# Altium project modFOC-ESC.PrjPcb
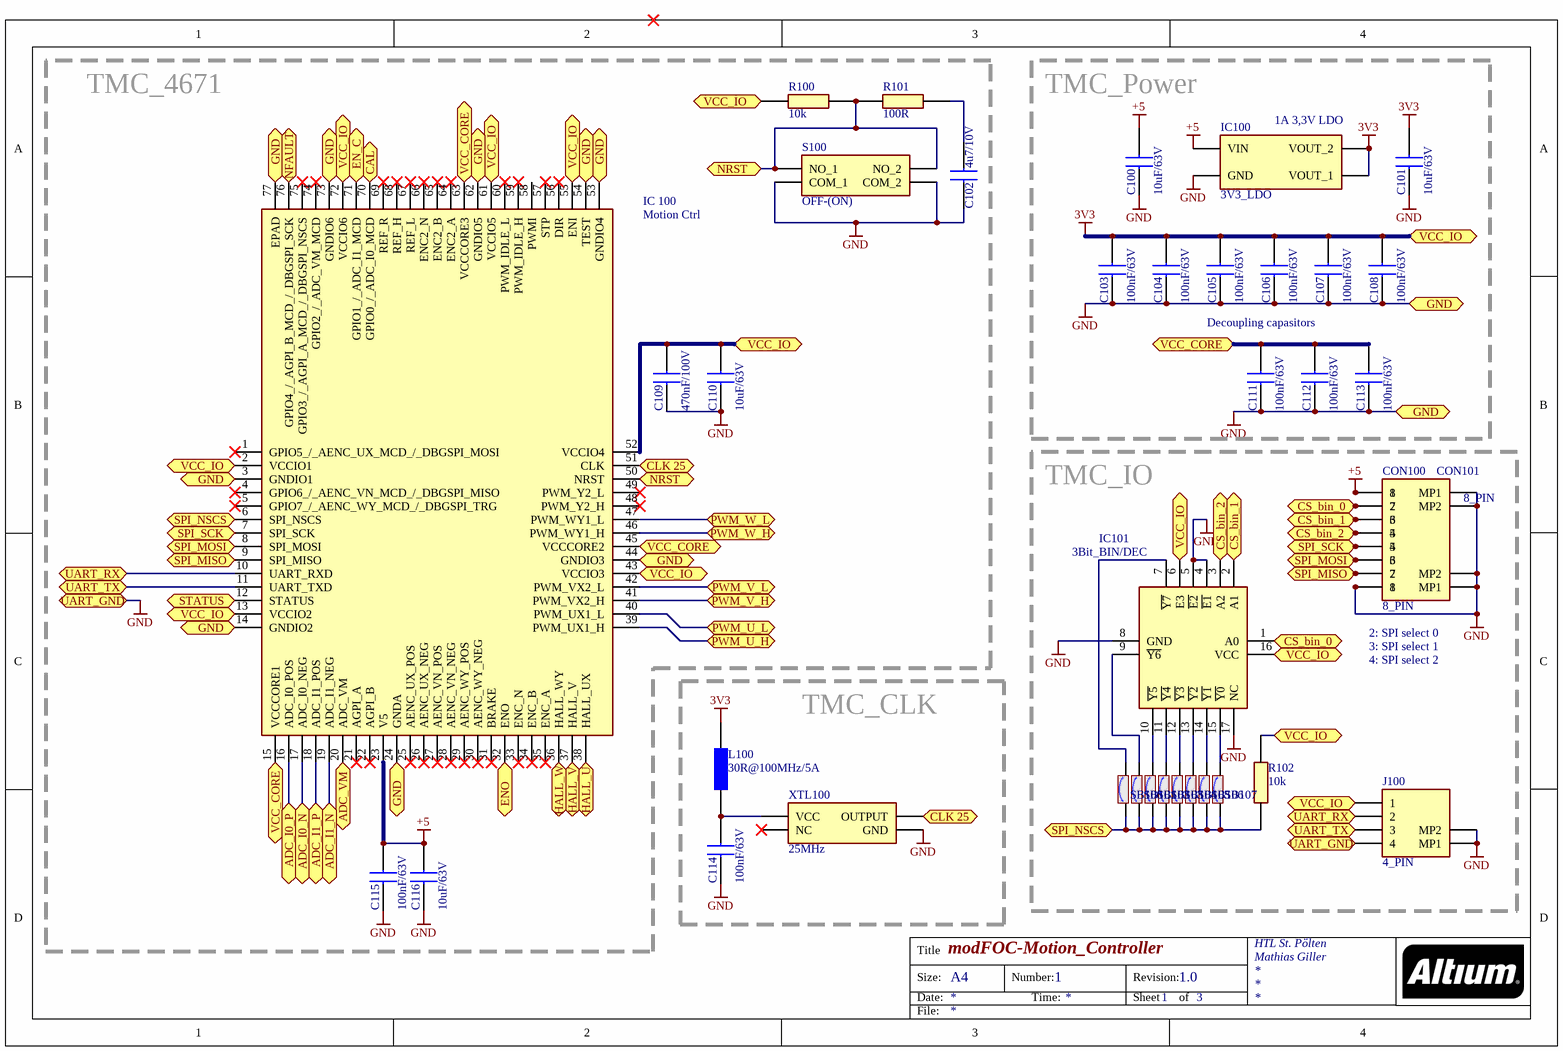
[diagram p0: modFOC-Motion_Controller.SchDoc]
3 sheets, 112 parts. Net scope: flat (ports and power ports of the same name join across sheets).
Board file: modFOC_ESC.PcbDoc
Sheets:
  modFOC-Motion_Controller.SchDoc
  modFOC-Sensing.SchDoc
  modFOC-Powerstage.SchDoc

## Sheet modFOC-Motion_Controller.SchDoc: modFOC-Motion_Controller
size A4; Date: dssd; Organization: HTL St. Pölten; Address1: Mathias Giller; DocumentNumber: 1; Revision: 1.0; SheetNumber: 1; SheetTotal: 3

### Parts
C100  10uF/63V  [CAPC3225X280N]
C101  10uF/63V  [CAPC3225X280N]
C102  4u7/10V  [CAPC1608X90N]
C103  100nF/63V  [CAPC1608X97N]
C104  100nF/63V  [CAPC1608X97N]
C105  100nF/63V  [CAPC1608X97N]
C106  100nF/63V  [CAPC1608X97N]
C107  100nF/63V  [CAPC1608X97N]
C108  100nF/63V  [CAPC1608X97N]
C109  470nF/100V  [CAPC2012X140N]
C110  10uF/63V  [CAPC3225X280N]
C111  100nF/63V  [CAPC1608X97N]
C112  100nF/63V  [CAPC1608X97N]
C113  100nF/63V  [CAPC1608X97N]
C114  100nF/63V  [CAPC1608X97N]
C115  100nF/63V  [CAPC1608X97N]
C116  10uF/63V  [CAPC3225X280N]
CON100  8_PIN  [DF13A8P125H21]
CON101  8_PIN  [DF13A8P125H21]
IC100  3V3_LDO  [SOT230P700X180-4N]
IC101  3Bit_BIN/DEC  [74HCT595BQ115]
IC_100  Motion Ctrl  [QFN40P1050X650X90-77N]
J100  4_PIN  [DF13A4P125H21]
L100  30R@100MHz/5A  [BLM18KG101TH1D]
R100  10k  [RESC1608X55N]
R101  100R  [RESC1608X55N]
R102  10k  [RESC1608X55N]
S100  OFF-(ON)  [PTS647SK38SMTR2LFS]
SB100  Solder Bridge  [SOLDER-BRIDGE_R0603-0R]  (value not drawn)
SB101  Solder Bridge  [SOLDER-BRIDGE_R0603-0R]  (value not drawn)
SB102  Solder Bridge  [SOLDER-BRIDGE_R0603-0R]  (value not drawn)
SB103  Solder Bridge  [SOLDER-BRIDGE_R0603-0R]  (value not drawn)
SB104  Solder Bridge  [SOLDER-BRIDGE_R0603-0R]  (value not drawn)
SB105  Solder Bridge  [SOLDER-BRIDGE_R0603-0R]  (value not drawn)
SB106  Solder Bridge  [SOLDER-BRIDGE_R0603-0R]  (value not drawn)
SB107  Solder Bridge  [SOLDER-BRIDGE_R0603-0R]  (value not drawn)
XTL100  25MHz  [FOX924B25]

### Blocks framed on the sheet
TMC_4671: C102 C109 C110 C115 C116 IC_100 R100 R101 S100
TMC_Power: C100 C101 C103-C108 C111-C113 IC100
TMC_IO: CON100 CON101 IC101 J100 R102 SB100-SB107
TMC_CLK: C114 L100 XTL100

### Ports
ADC_I0_N (bidir), ADC_I0_P (bidir), ADC_I1_N (bidir), ADC_I1_P (bidir), ADC_VM (bidir), CAL (bidir), CLK 25 (bidir), CS_bin_0 (bidir), CS_bin_1 (bidir), CS_bin_2 (bidir), EN_C (bidir), ENO (bidir), GND (bidir), HALL_U (bidir), HALL_V (bidir), HALL_W (bidir), NFAULT (bidir), NRST (bidir), PWM_U_H (bidir), PWM_U_L (bidir), PWM_V_H (bidir), PWM_V_L (bidir), PWM_W_H (bidir), PWM_W_L (bidir), SPI_MISO (bidir), SPI_MOSI (bidir), SPI_NSCS (bidir), SPI_SCK (bidir), STATUS (bidir), UART_GND (bidir), UART_RX (bidir), UART_TX (bidir), VCC_CORE (bidir), VCC_IO (bidir)

### Nets
3V3: C101.1 C103.2 C104.2 C105.2 C106.2 C107.2 C108.2 C109.2 C110.1 IC100.2(VOUT_1) IC100.4(VOUT_2) IC101.6(E3) IC101.16(VCC) IC_100.2(VCCIO1) IC_100.13(VCCIO2) IC_100.43(VCCIO3) IC_100.52(VCCIO4) IC_100.55(ENI) IC_100.61(VCCIO5) IC_100.72(VCCIO6) J100.1 L100.1 R100.1 R102.2 ; port VCC_IO
+5: C100.1 C115.2 C116.1 CON100.1 CON101.8 IC100.3(VIN) IC_100.23(V5)
GND: C100.2 C101.2 C102.1 C103.1 C104.1 C105.1 C106.1 C107.1 C108.1 C109.1 C110.2 C111.1 C112.1 C113.1 C114.1 C115.1 C116.2 CON100.8 CON100.MP1 CON100.MP2 CON101.1 CON101.MP1 CON101.MP2 IC100.1(GND) IC101.4(~{E1}) IC101.5(~{E2}) IC101.8(GND) IC101.17(NC) IC_100.3(GNDIO1) IC_100.14(GNDIO2) IC_100.24(GNDA) IC_100.44(GNDIO3) IC_100.53(GNDIO4) IC_100.54(TEST) IC_100.62(GNDIO5) IC_100.73(GNDIO6) IC_100.77(EPAD) J100.4 J100.MP1 J100.MP2 S100.3(COM_1) S100.4(COM_2) XTL100.2(GND) ; port GND, port UART_GND
ADC_I0_N: IC_100.17(ADC_I0_NEG) ; port ADC_I0_N
ADC_I0_P: IC_100.16(ADC_I0_POS) ; port ADC_I0_P
ADC_I1_N: IC_100.19(ADC_I1_NEG) ; port ADC_I1_N
ADC_I1_P: IC_100.18(ADC_I1_POS) ; port ADC_I1_P
ADC_VM: IC_100.20(ADC_VM) ; port ADC_VM
CAL: IC_100.70(GPIO0_/_ADC_I0_MCD) ; port CAL
CLK 25: IC_100.51(CLK) XTL100.3(OUTPUT) ; port CLK 25
CS_bin_0: CON100.2 CON101.7 IC101.1(A0) ; port CS_bin_0
CS_bin_1: CON100.3 CON101.6 IC101.2(A1) ; port CS_bin_1
CS_bin_2: CON100.4 CON101.5 IC101.3(A2) ; port CS_bin_2
EN_C: IC_100.71(GPIO1_/_ADC_I1_MCD) ; port EN_C
ENO: IC_100.32(ENO) ; port ENO
HALL_U: IC_100.38(HALL_UX) ; port HALL_U
HALL_V: IC_100.37(HALL_V) ; port HALL_V
HALL_W: IC_100.36(HALL_WY) ; port HALL_W
NFAULT: IC_100.76(GPIO4_/_AGPI_B_MCD_/_DBGSPI_SCK) ; port NFAULT
NRST: IC_100.50(NRST) R100.2 R101.1 S100.1(NO_1) S100.2(NO_2) ; port NRST
PWM_U_H: IC_100.39(PWM_UX1_H) ; port PWM_U_H
PWM_U_L: IC_100.40(PWM_UX1_L) ; port PWM_U_L
PWM_V_H: IC_100.41(PWM_VX2_H) ; port PWM_V_H
PWM_V_L: IC_100.42(PWM_VX2_L) ; port PWM_V_L
PWM_W_H: IC_100.46(PWM_WY1_H) ; port PWM_W_H
PWM_W_L: IC_100.47(PWM_WY1_L) ; port PWM_W_L
SPI_MISO: CON100.7 CON101.2 IC_100.9(SPI_MISO) ; port SPI_MISO
SPI_MOSI: CON100.6 CON101.3 IC_100.8(SPI_MOSI) ; port SPI_MOSI
SPI_NSCS: IC_100.6(SPI_NSCS) R102.1 SB100.1 SB101.1 SB102.1 SB103.1 SB104.1 SB105.1 SB106.1 SB107.1 ; port SPI_NSCS
SPI_SCK: CON100.5 CON101.4 IC_100.7(SPI_SCK) ; port SPI_SCK
STATUS: IC_100.12(STATUS) ; port STATUS
UART_RX: IC_100.10(UART_RXD) J100.2 ; port UART_RX
UART_TX: IC_100.11(UART_TXD) J100.3 ; port UART_TX
VCC_CORE: C111.2 C112.2 C113.2 IC_100.15(VCCCORE1) IC_100.45(VCCCORE2) IC_100.63(VCCCORE3) ; port VCC_CORE
NetC102_2: C102.2 R101.2
NetC114_2: C114.2 L100.2 XTL100.4(VCC)
NetIC101_7: IC101.7(~{Y7}) SB100.2
NetIC101_9: IC101.9(~{Y6}) SB101.2
NetIC101_10: IC101.10(~{Y5}) SB102.2
NetIC101_11: IC101.11(~{Y4}) SB103.2
NetIC101_12: IC101.12(~{Y3}) SB104.2
NetIC101_13: IC101.13(~{Y2}) SB105.2
NetIC101_14: IC101.14(~{Y1}) SB106.2
NetIC101_15: IC101.15(~{Y0}) SB107.2

Not connected (* = marked no-connect by the designer): IC_100 1(GPIO5_/_AENC_UX_MCD_/_DBGSPI_MOSI)* 4(GPIO6_/_AENC_VN_MCD_/_DBGSPI_MISO)* 5(GPIO7_/_AENC_WY_MCD_/_DBGSPI_TRG)* 21(AGPI_A)* 22(AGPI_B)* 25(AENC_UX_POS)* 26(AENC_UX_NEG)* 27(AENC_VN_POS)* 28(AENC_VN_NEG)* 29(AENC_WY_POS)* 30(AENC_WY_NEG)* 31(BRAKE)* 33(ENC_N)* 34(ENC_B)* 35(ENC_A)* 48(PWM_Y2_H)* 49(PWM_Y2_L)* 56(DIR)* 57(STP)* 58(PWMI) 59(PWM_IDLE_H)* 60(PWM_IDLE_L)* 64(ENC2_A)* 65(ENC2_B)* 66(ENC2_N)* 67(REF_L)* 68(REF_H)* 69(REF_R)* 74(GPIO2_/_ADC_VM_MCD)* 75(GPIO3_/_AGPI_A_MCD_/_DBGSPI_NSCS)*; XTL100 1(NC)*

### Notes on the sheet
- (near IC100) 1A 3,3V LDO
- Decoupling capasitors
- 2: SPI select 0
- 3: SPI select 1
- 4: SPI select 2
- Title
- Size:
- Date:
- A4
- Number:
- Time:
- Revision:
- Sheet
- of
- File:

### Library data of the parts
C100 C101 C110 C116 = CL32B106KMVNNWE: Capacitor; Manufacturer_Name: Samsung Electro-Mechanics; Datasheet Link: https://www.arrow.com/en/products/cl32b106kmvnnwe/samsung-electro-mechanics; Height: 2.8mm; Manufacturer_Part_Number: CL32B106KMVNNWE; Arrow Part Number: CL32B106KMVNNWE; Arrow Price/Stock: https://www.arrow.com/en/products/cl32b106kmvnnwe/samsung-electro-mechanics; Mouser Part Number: 187-CL32B106KMVNNWE; Mouser Price/Stock: https://www.mouser.co.uk/ProductDetail/Samsung-Electro-Mechanics/CL32B106KMVNNWE?qs=xZ%2FP%252Ba9zWqaEMBbSgKy8gQ%3D%3D
C102 = CL10A475KP8NNNC: Capacitor; Manufacturer_Name: Samsung Electro-Mechanics; Datasheet Link: https://www.arrow.com/en/products/cl10a475kp8nnnc/samsung-electro-mechanics; Height: 0.9mm; Manufacturer_Part_Number: CL10A475KP8NNNC; Mouser Part Number: 187-CL10A475KP8NNNC; Mouser Price/Stock: https://www.mouser.co.uk/ProductDetail/Samsung-Electro-Mechanics/CL10A475KP8NNNC/?qs=hqM3L16%252BxlfQRmkWsZz5vA%3D%3D; Arrow Part Number: CL10A475KP8NNNC; Arrow Price/Stock: https://www.arrow.com/en/products/cl10a475kp8nnnc/samsung-electro-mechanics
C103-C108 C111-C115 = C0805C104MMREC7210: Capacitor; Manufacturer_Name: Vishay; Manufacturer_Part_Number: VJ0603Y104JXJAC; Datasheet Link: http://www.vishay.com/docs/45226/vj31xrohsautomlcc.pdf; Height: 1mm; Mouser Part Number: 77-VJ0603Y104JXJAC; Mouser Price/Stock: https://www.mouser.com/Search/Refine.aspx?Keyword=77-VJ0603Y104JXJAC
C109 = 08051C474KAT2A: Capacitor; Manufacturer_Name: AVX; Datasheet Link: http://datasheets.avx.com/X7RDielectric.pdf; Height: 1.4mm; Manufacturer_Part_Number: 08051C474KAT2A; Mouser Part Number: 581-08051C474KAT2A; Mouser Price/Stock: https://www.mouser.co.uk/ProductDetail/AVX/08051C474KAT2A?qs=%2FjdEcI0p95Mz%2FN5KbrGN6Q%3D%3D
CON100 CON101 = DF13A-8P-1.25H_21_: Connector; Manufacturer_Name: Hirose; Manufacturer_Part_Number: DF13A-8P-1.25H(21); Datasheet Link: http://uk.rs-online.com/web/p/products/7793617P; Height: 3.6mm; Mouser Part Number: 798-DF13A8P125H21; Mouser Price/Stock: https://www.mouser.co.uk/ProductDetail/Hirose-Connector/DF13A-8P-125H21?qs=XQjbzJWzFPViW0MGk5%2FVbA%3D%3D
IC100 = AP2114H-3.3TRG1: Integrated Circuit; Manufacturer_Name: Diodes Inc.; Datasheet Link: http://uk.rs-online.com/web/p/products/8283528; Height: 1.8mm; Manufacturer_Part_Number: AP2114H-3.3TRG1; Arrow Part Number: AP2114H-3.3TRG1; Arrow Price/Stock: https://www.arrow.com/en/products/ap2114h-3.3trg1/diodes-incorporated; Mouser Part Number: 621-AP2114H-3.3TRG1; Mouser Price/Stock: https://www.mouser.co.uk/ProductDetail/Diodes-Incorporated/AP2114H-33TRG1?qs=x6A8l6qLYDDSG%2FfwzcsOhw%3D%3D
IC101 = 74LVC138ABQ,115: Integrated Circuit; Manufacturer_Name: Nexperia; Datasheet Link: https://assets.nexperia.com/documents/data-sheet/74LVC138A.pdf; Manufacturer_Part_Number: 74LVC138ABQ,115; Arrow Part Number: 74LVC138ABQ,115; Arrow Price/Stock: https://www.arrow.com/en/products/74lvc138abq115/nexperia; Mouser Part Number: 771-LVC138ABQ115; Mouser Price/Stock: https://www.mouser.co.uk/ProductDetail/Nexperia/74LVC138ABQ115?qs=me8TqzrmIYUqHGpwzmLq4w%3D%3D
IC_100 = TMC4671-LA IC: FOC Motion Controller; Manufacturer_Name: Trinamic; Manufacturer_Part_Number: TMC4671-LA
J100 = DF13A-4P-1.25H_21_: Connector; Manufacturer_Name: Hirose; Manufacturer_Part_Number: DF13A-4P-1.25H(21); Datasheet Link: https://componentsearchengine.com/Datasheets/1/DF13A-4P-1.25H(21).pdf; Height: 3.6mm; Mouser Part Number: 798-DF13A4P125H21; Mouser Price/Stock: https://www.mouser.co.uk/ProductDetail/Hirose-Connector/DF13A-4P-125H21/?qs=XQjbzJWzFPXWzMShI70F0w%3D%3D
L100 = BLM18KG300TH1D: Ferrite Bead; Manufacturer_Name: Murata Electronics; Datasheet Link: https://www.murata.com/en-us/products/productdetail?partno=BLM18KG300TH1%23; Height: 0.75mm; Manufacturer_Part_Number: BLM18KG300TH1D; Arrow Part Number: BLM18KG300TH1D; Arrow Price/Stock: https://www.arrow.com/en/products/blm18kg300th1d/murata-manufacturing; Mouser Part Number: 81-BLM18KG300TH1D; Mouser Price/Stock: https://www.mouser.com/Search/Refine.aspx?Keyword=81-BLM18KG300TH1D
R100 R102 = RC0603FR-0710KL: Resistor; Manufacturer_Name: YAGEO (PHYCOMP); Datasheet Link: http://www.yageo.com/documents/recent/PYu-RC0603_51_RoHS_L_v5.pdf; Height: 0.55mm; Manufacturer_Part_Number: RC0603FR-0710KL; Arrow Part Number: RC0603FR-0710KL; Arrow Price/Stock: https://www.arrow.com/en/products/rc0603fr-0710kl/yageo; Mouser Part Number: 603-RC0603FR-0710KL; Mouser Price/Stock: https://www.mouser.co.uk/ProductDetail/Yageo/RC0603FR-0710KL?qs=grNVn54RoB%252B3GtjbJj3wJQ%3D%3D
R101 = CRCW0603100RFKEAC: Resistor; Manufacturer_Name: Vishay; Datasheet Link: https://componentsearchengine.com/Datasheets/1/CRCW0603100RFKEAC.pdf; Height: 0.55mm; Manufacturer_Part_Number: CRCW0603100RFKEAC; Mouser Part Number: 71-CRCW0603100RFKEAC; Mouser Price/Stock: https://www.mouser.co.uk/ProductDetail/Vishay-Dale/CRCW0603100RFKEAC/?qs=E3Y5ESvWgWPJqb4%2F19sAKw%3D%3D; Arrow Part Number: CRCW0603100RFKEAC; Arrow Price/Stock: https://www.arrow.com/en/products/crcw0603100rfkeac/vishay
S100 = PTS647SK38SMTR2LFS: Switch; Manufacturer_Name: C & K COMPONENTS; Datasheet Link: https://www.ckswitches.com/media/2567/pts647.pdf; Height: 3.8mm; Manufacturer_Part_Number: PTS647SK38SMTR2LFS; Mouser Part Number: 611-PTS647SK38SMTR2L; Mouser Price/Stock: https://www.mouser.co.uk/ProductDetail/CK/PTS647SK38SMTR2LFS/?qs=PqoDHHvF649Jgx1Ch2uMjg%3D%3D
SB100-SB107 = Solder Bridge: Internal_Part_Number: MCD-00071; Part_Type: Mechanical; Manufacturer_Part_Number: RC0603JR-070RL; Manufacturer: YAGEO; Provided_By: SUBCO; ECCN_US: n/a; ECCN_EU: n/a; Status: Released; Package: SB0603; ComponentLink1Description: Datasheet; ComponentLink1URL: http://tunmcdsvn.tun.st.com/Component_Datasheet_Library/Trunk/Resistors/Yageo_Resistor_RC0603-series
XTL100 = FOX924B-25: 25Mhz Oscillator; Manufacturer_Name: FOX; Manufacturer_Part_Number: FOX924B-25

## Sheet modFOC-Sensing.SchDoc: modFOC-Sensing
size A4; Organization: HTL St. Pölten; Address1: Mathias Giller; DocumentNumber: 2; Revision: 1; SheetNumber: 2; SheetTotal: 3
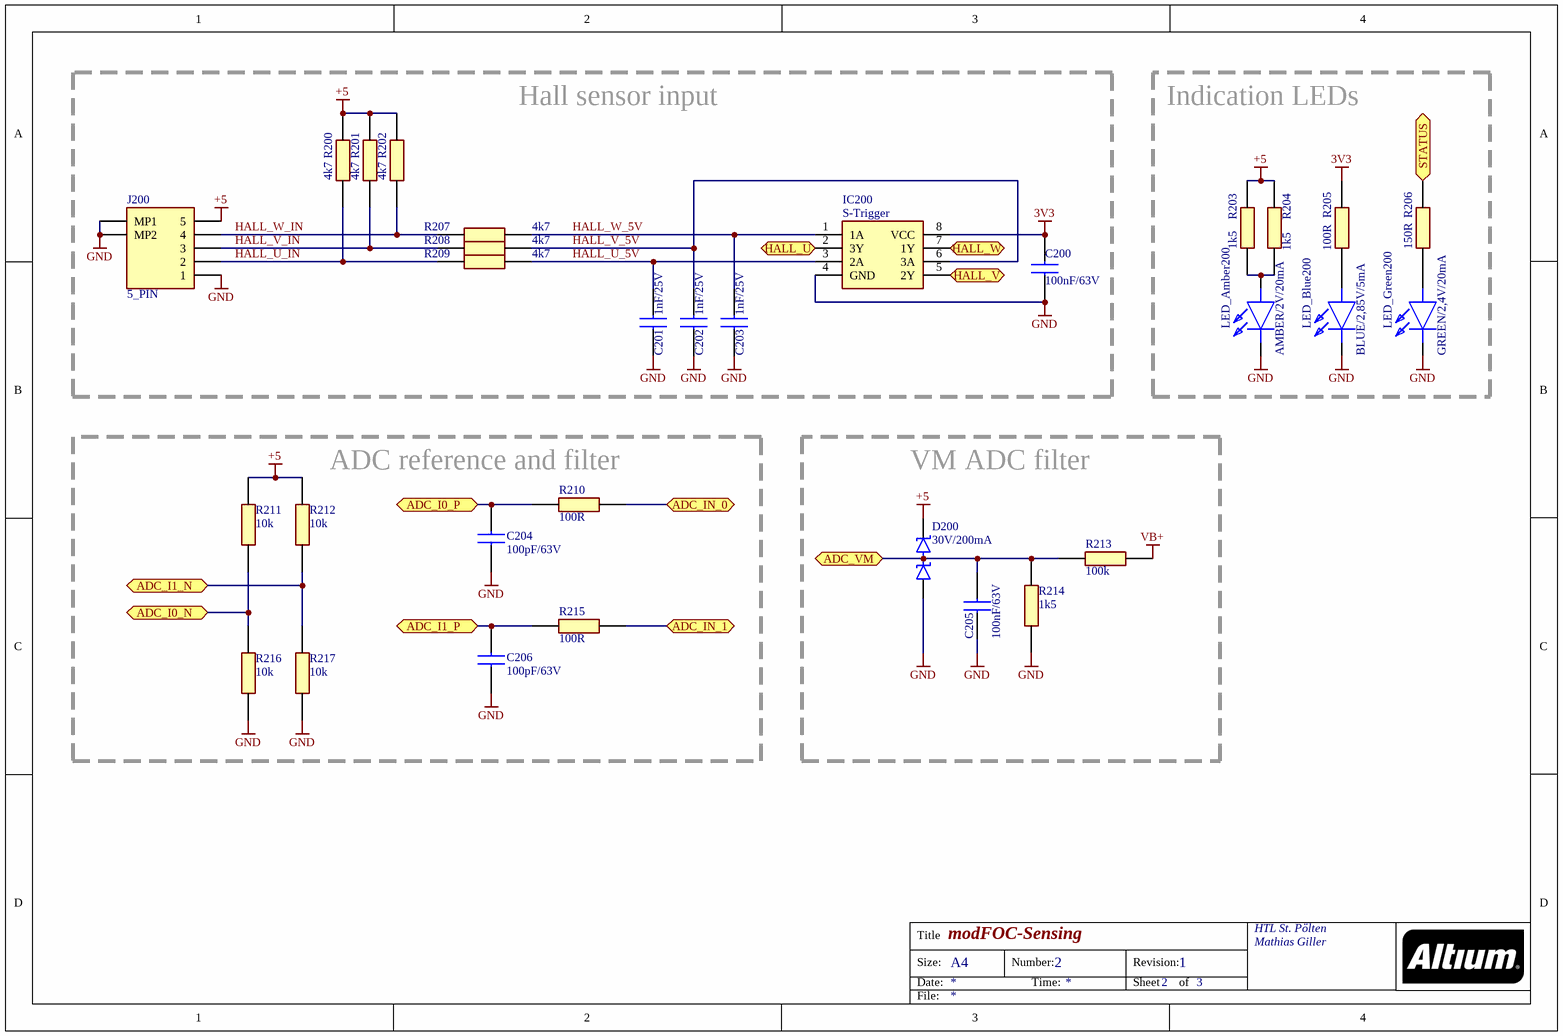
[diagram p1: modFOC-Sensing.SchDoc]

### Parts
C200  100nF/63V  [CAPC1608X97N]
C201  1nF/25V  [CAPC1608X97N]
C202  1nF/25V  [CAPC1608X97N]
C203  1nF/25V  [CAPC1608X97N]
C204  100pF/63V  [CAPC1608X87N]
C205  100nF/63V  [CAPC1608X97N]
C206  100pF/63V  [CAPC1608X87N]
D200  30V/200mA  [SOT95P240X110-3N]
IC200  S-Trigger  [SOP65P400X110-8N]
J200  5_PIN  [DF13A5P125H21]
LED_Amber200  AMBER/2V/20mA  [LEDC1608X55N]
LED_Blue200  BLUE/2,85V/5mA  [LEDC1608X40N]
LED_Green200  GREEN/2,4V/20mA  [LGQ396PS35]
R200  4k7  [RESC1608X55N]
R201  4k7  [RESC1608X55N]
R202  4k7  [RESC1608X55N]
R203  1k5  [RESC1608X55N]
R204  1k5  [RESC1608X55N]
R205  100R  [RESC1608X55N]
R206  150R  [RESC1608X55N]
R207  4k7  [RESC1608X55N]
R208  4k7  [RESC1608X55N]
R209  4k7  [RESC1608X55N]
R210  100R  [RESC1608X55N]
R211  10k  [RESC1608X55N]
R212  10k  [RESC1608X55N]
R213  100k  [RESC1608X55N]
R214  1k5  [RESC1608X55N]
R215  100R  [RESC1608X55N]
R216  10k  [RESC1608X55N]
R217  10k  [RESC1608X55N]

### Blocks framed on the sheet
Hall sensor input: C200-C203 IC200 J200 R200-R202 R207-R209
Indication LEDs: LED_Amber200 LED_Blue200 LED_Green200 R203-R206
ADC reference and filter: C204 C206 R210-R212 R215-R217
VM ADC filter: C205 D200 R213 R214

### Ports
ADC_I0_N (bidir), ADC_I0_P (bidir), ADC_I1_N (bidir), ADC_I1_P (bidir), ADC_IN_0 (bidir), ADC_IN_1 (bidir), ADC_VM (bidir), HALL_U (bidir), HALL_V (bidir), HALL_W (bidir), STATUS (bidir)

### Nets
3V3: C200.2 IC200.8(VCC) R205.2
+5: D200.2(K) J200.5 R200.1 R201.1 R202.1 R203.2 R204.2 R211.2 R212.1
GND: C200.1 C201.2 C202.2 C203.2 C204.1 C205.1 C206.1 D200.1(A) IC200.4(GND) J200.1 J200.MP1 J200.MP2 LED_Amber200.1(K) LED_Blue200.1(K) LED_Green200.1(K) R214.1 R216.2 R217.2
VB+: R213.2
ADC_I0_N: R211.1 R216.1 ; port ADC_I0_N
ADC_I0_P: C204.2 R210.1 ; port ADC_I0_P
ADC_I1_N: R212.2 R217.1 ; port ADC_I1_N
ADC_I1_P: C206.2 R215.1 ; port ADC_I1_P
ADC_IN_0: R210.2 ; port ADC_IN_0
ADC_IN_1: R215.2 ; port ADC_IN_1
ADC_VM: C205.2 D200.3(A/K) R213.1 R214.2 ; port ADC_VM
HALL_U: IC200.2(3Y) ; port HALL_U
HALL_U_5V: C201.1 IC200.3(2A) R209.2
HALL_U_IN: J200.2 R200.2 R209.1
HALL_V: IC200.5(2Y) ; port HALL_V
HALL_V_5V: C202.1 IC200.6(3A) R208.2
HALL_V_IN: J200.3 R201.2 R208.1
HALL_W: IC200.7(1Y) ; port HALL_W
HALL_W_5V: C203.1 IC200.1(1A) R207.2
HALL_W_IN: J200.4 R202.2 R207.1
STATUS: R206.2 ; port STATUS
NetLED_Amber200_2: LED_Amber200.2(A) R203.1 R204.1
NetLED_Blue200_2: LED_Blue200.2(A) R205.1
NetLED_Green200_2: LED_Green200.2(A) R206.1

### Notes on the sheet
- Title
- Size:
- Date:
- A4
- Number:
- Time:
- Revision:
- Sheet
- of
- File:

### Library data of the parts
C200 C205 = C0805C104MMREC7210: as C103 on sheet modFOC-Motion_Controller; Datasheet Link: http://www.vishay.com/docs/45226/vj31xrohsautomlcc.pdf; Height: 1mm; Mouser Part Number: 77-VJ0603Y104JXJAC; Mouser Price/Stock: https://www.mouser.com/Search/Refine.aspx?Keyword=77-VJ0603Y104JXJAC
C201-C203 = GRM033R71E102KA01D: Capacitor; Manufacturer_Name: Murata Electronics; Datasheet Link: https://psearch.en.murata.com/capacitor/product/GRM033R71E102KA01%23.html; Height: 0.33mm; Manufacturer_Part_Number: GRM033R71E102KA01D; Mouser Part Number: 81-GRM033R71E102KA1D; Mouser Price/Stock: https://www.mouser.co.uk/ProductDetail/Murata-Electronics/GRM033R71E102KA01D/?qs=%252BwCMEOx2S5vqymn%2Fc34U1A%3D%3D; Arrow Part Number: GRM033R71E102KA01D; Arrow Price/Stock: https://www.arrow.com/en/products/grm033r71e102ka01d/murata-manufacturing
C204 C206 = C0603C101K1HACTU: Capacitor; Manufacturer_Name: Kemet; Datasheet Link: https://www.mouser.com/datasheet/2/212/KEM_C1007_X8R_ULTRA_150C_SMD-1102703.pdf; Height: 0.87mm; Manufacturer_Part_Number: C0603C101K1HACTU; Mouser Part Number: 80-C0603C101K1HACTU; Mouser Price/Stock: https://www.mouser.co.uk/ProductDetail/KEMET/C0603C101K1HACTU?qs=W0yvOO0ixfE5G01qpfeqIQ%3D%3D
D200 = BAT54S: Schottky Diode; Manufacturer_Name: Rectron; Datasheet Link: https://www.rectron.com/data_sheets/bat54s.pdf; Height: 1.1mm; Manufacturer_Part_Number: BAT54S; Mouser Part Number: 583-BAT54S; Mouser Price/Stock: https://www.mouser.co.uk/ProductDetail/Rectron/BAT54S?qs=7pEAo90IqNGRiqD7TkybWA%3D%3D; Arrow Part Number: BAT54S; Arrow Price/Stock: https://www.arrow.com/en/products/bat54s/rectron
IC200 = 74LVC3G17DP,125: Integrated Circuit; Manufacturer_Name: Nexperia; Datasheet Link: https://assets.nexperia.com/documents/data-sheet/74LVC3G17.pdf; Height: 1.1mm; Manufacturer_Part_Number: 74LVC3G17DP,125; Mouser Part Number: 771-LVC3G17DP125; Mouser Price/Stock: https://www.mouser.co.uk/ProductDetail/Nexperia/74LVC3G17DP125?qs=me8TqzrmIYUUngWcw0uHGA%3D%3D; Arrow Part Number: 74LVC3G17DP,125; Arrow Price/Stock: https://www.arrow.com/en/products/74lvc3g17dp125/nexperia
J200 = DF13A-5P-1.25H_21_: Connector; Manufacturer_Name: Hirose; Manufacturer_Part_Number: DF13A-5P-1.25H(21); Datasheet Link: https://componentsearchengine.com/Datasheets/1/DF13A-5P-1.25H(21).pdf; Height: 3.75mm; Mouser Part Number: 798-DF13A5P125H21; Mouser Price/Stock: https://www.mouser.co.uk/ProductDetail/Hirose-Connector/DF13A-5P-125H21?qs=XQjbzJWzFPWvJsE2o%252B4Q8Q%3D%3D
LED_Amber200 = ASMT-RA45-AP932: LED; Manufacturer_Name: Avago Technologies; Datasheet Link: https://docs.broadcom.com/docs/AV02-0378EN; Height: 0.55mm; Manufacturer_Part_Number: ASMT-RA45-AP932; Mouser Part Number: 630-ASMT-RA45-AP932; Mouser Price/Stock: https://www.mouser.co.uk/ProductDetail/Broadcom-Avago/ASMT-RA45-AP932?qs=7zQgkplsu%2FO5gZneoB42ug%3D%3D
LED_Blue200 = LB_Q39G-L2OO-35-1: LED; Manufacturer_Name: OSRAM; Manufacturer_Part_Number: LB Q39G-L2OO-35-1; Datasheet Link: http://www.mouser.com/ds/2/311/LB Q39G - CHIPLED 0603-553388.pdf; Height: 0.4mm; Mouser Part Number: 720-LBQ39GL2N2351; Mouser Price/Stock: https://www.mouser.co.uk/ProductDetail/OSRAM-Opto-Semiconductors/LB-Q39G-L2OO-35-1?qs=74fRo9GAWsxvZBH6a5xY%252BA%3D%3D; Arrow Part Number: LB Q39G-L2OO-35-1; Arrow Price/Stock: https://www.arrow.com/en/products/lbq39g-l2oo-35-1/osram-opto-semiconductors
LED_Green200 = LG_Q396-PS-35: LED; Manufacturer_Name: OSRAM; Manufacturer_Part_Number: LG Q396-PS-35; Datasheet Link: https://mouser.componentsearchengine.com/Datasheets/2/LG%20Q396-PS-35.pdf; Height: 0.4mm; Mouser Part Number: 720-LGQ396A3964; Mouser Price/Stock: https://www.mouser.co.uk/ProductDetail/OSRAM-Opto-Semiconductors/LG-Q396-PS-35?qs=xC%252BE9h5iuX5%252BCocujXxOpw%3D%3D; Arrow Part Number: LG Q396-PS-35; Arrow Price/Stock: https://www.arrow.com/en/products/lgq396-ps-35/osram-opto-semiconductors
R200-R202 R207-R209 = CRCW06034K70JNEAC: Resistor; Manufacturer_Name: Vishay; Datasheet Link: http://www.vishay.com/docs/28773/crcwce3.pdf; Height: 0.55mm; Manufacturer_Part_Number: CRCW06034K70JNEAC; Mouser Part Number: 71-CRCW06034K70JNEAC; Mouser Price/Stock: https://www.mouser.co.uk/ProductDetail/Vishay-Dale/CRCW06034K70JNEAC/?qs=E3Y5ESvWgWMzBuUf0K3dnA%3D%3D; Arrow Part Number: CRCW06034K70JNEAC; Arrow Price/Stock: https://www.arrow.com/en/products/crcw06034k70jneac/vishay
R203 R204 R214 = ERJ1GNF1501C: Resistor; Manufacturer_Name: Panasonic; Datasheet Link: https://industrial.panasonic.com/cdbs/www-data/pdf/RDA0000/AOA0000C84.pdf; Height: 0.26mm; Manufacturer_Part_Number: ERJ1GNF1501C
R205 R210 R215 = CRCW0603100RFKEAC: Resistor; Manufacturer_Name: Vishay; Datasheet Link: https://componentsearchengine.com/Datasheets/1/CRCW0603100RFKEAC.pdf; Height: 0.55mm; Manufacturer_Part_Number: CRCW0603100RFKEAC; Mouser Part Number: 71-CRCW0603100RFKEAC; Mouser Price/Stock: https://www.mouser.co.uk/ProductDetail/Vishay-Dale/CRCW0603100RFKEAC/?qs=E3Y5ESvWgWPJqb4%2F19sAKw%3D%3D; Arrow Part Number: CRCW0603100RFKEAC; Arrow Price/Stock: https://www.arrow.com/en/products/crcw0603100rfkeac/vishay
R206 = SFR03EZPF1500: Resistor; Manufacturer_Name: ROHM Semiconductor; Datasheet Link: https://componentsearchengine.com/Datasheets/1/SFR03EZPF1500.pdf; Height: 0.55mm; Manufacturer_Part_Number: SFR03EZPF1500; Mouser Part Number: 755-SFR03EZPF1500; Mouser Price/Stock: https://www.mouser.com/Search/Refine.aspx?Keyword=755-SFR03EZPF1500
R211 R212 R216 R217 = RC0603FR-0710KL: as R100 on sheet modFOC-Motion_Controller; Datasheet Link: http://www.yageo.com/documents/recent/PYu-RC0603_51_RoHS_L_v5.pdf; Height: 0.55mm; Manufacturer_Part_Number: RC0603FR-0710KL; Arrow Part Number: RC0603FR-0710KL; Arrow Price/Stock: https://www.arrow.com/en/products/rc0603fr-0710kl/yageo; Mouser Part Number: 603-RC0603FR-0710KL; Mouser Price/Stock: https://www.mouser.co.uk/ProductDetail/Yageo/RC0603FR-0710KL?qs=grNVn54RoB%252B3GtjbJj3wJQ%3D%3D
R213 = ERJ1GNF1003C: Resistor; Manufacturer_Name: Panasonic; Datasheet Link: https://industrial.panasonic.com/cdbs/www-data/pdf/RDA0000/AOA0000C84.pdf; Height: 0.26mm; Manufacturer_Part_Number: ERJ1GNF1003C; Arrow Part Number: ERJ1GNF1003C; Arrow Price/Stock: https://www.arrow.com/en/products/erj1gnf1003c/panasonic

## Sheet modFOC-Powerstage.SchDoc: modFOC-Powerstage
size A4; Organization: HTL St. Pölten; Address1: Mathias Giller; DocumentNumber: 3; Revision: 1; SheetNumber: 3; SheetTotal: 3
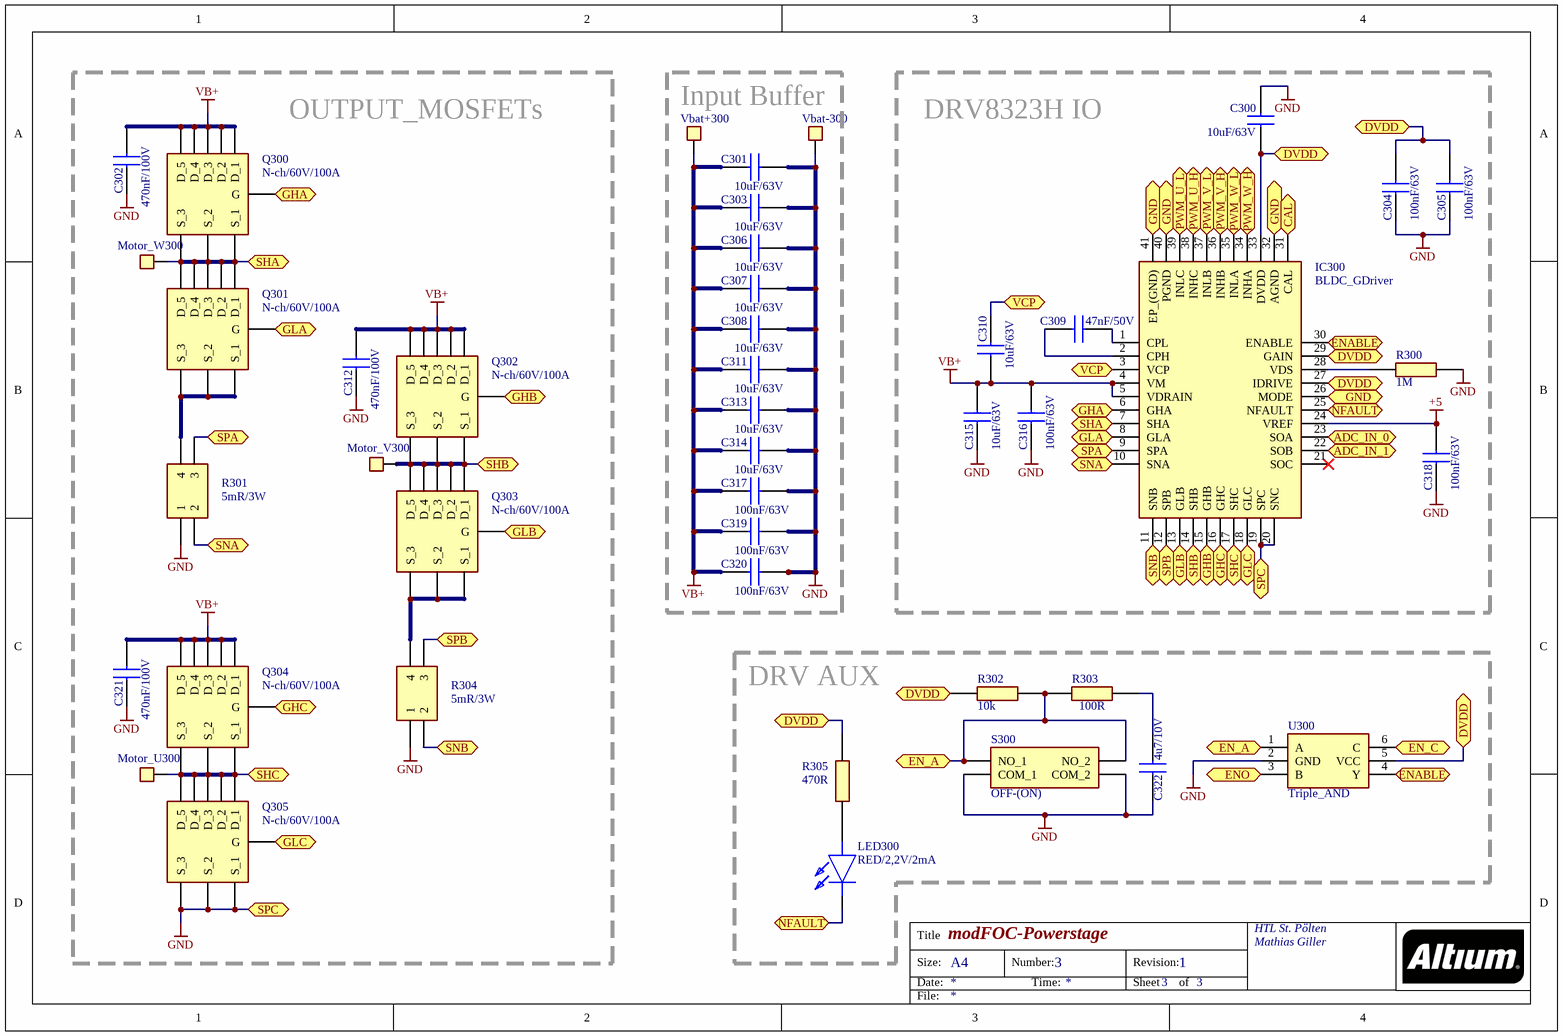
[diagram p2: modFOC-Powerstage.SchDoc]

### Parts
C300  10uF/63V  [CAPC3225X280N]
C301  10uF/63V  [CAPC3225X280N]
C302  470nF/100V  [CAPC2012X140N]
C303  10uF/63V  [CAPC3225X280N]
C304  100nF/63V  [CAPC1608X97N]
C305  100nF/63V  [CAPC1608X97N]
C306  10uF/63V  [CAPC3225X280N]
C307  10uF/63V  [CAPC3225X280N]
C308  10uF/63V  [CAPC3225X280N]
C309  47nF/50V  [CAPC1608X90N]
C310  10uF/63V  [CAPC3225X280N]
C311  10uF/63V  [CAPC3225X280N]
C312  470nF/100V  [CAPC2012X140N]
C313  10uF/63V  [CAPC3225X280N]
C314  10uF/63V  [CAPC3225X280N]
C315  10uF/63V  [CAPC3225X280N]
C316  100nF/63V  [CAPC1608X97N]
C317  100nF/63V  [CAPC1608X97N]
C318  100nF/63V  [CAPC1608X97N]
C319  100nF/63V  [CAPC1608X97N]
C320  100nF/63V  [CAPC1608X97N]
C321  470nF/100V  [CAPC2012X140N]
C322  4u7/10V  [CAPC1608X90N]
IC300  BLDC_GDriver  [QFN50P600X600X80-41N-D]
LED300  RED/2,2V/2mA  [LSL29KG1J21Z]
Motor_U300  PowerPad  [POWER_PAD]  (value not drawn)
Motor_V300  PowerPad  [POWER_PAD]  (value not drawn)
Motor_W300  PowerPad  [POWER_PAD]  (value not drawn)
Q300  N-ch/60V/100A  [TPHR9003NLL1Q]
Q301  N-ch/60V/100A  [TPHR9003NLL1Q]
Q302  N-ch/60V/100A  [TPHR9003NLL1Q]
Q303  N-ch/60V/100A  [TPHR9003NLL1Q]
Q304  N-ch/60V/100A  [TPHR9003NLL1Q]
Q305  N-ch/60V/100A  [TPHR9003NLL1Q]
R300  1M  [RESC1608X55N]
R301  5mR/3W  [WSK12161L000FEA]
R302  10k  [RESC1608X55N]
R303  100R  [RESC1608X55N]
R304  5mR/3W  [WSK12161L000FEA]
R305  470R  [RESC1608X55N]
S300  OFF-(ON)  [PTS647SK38SMTR2LFS]
U300  Triple_AND  [SOT95P285X140-6N]
Vbat+300  PW_PAD_SMOL  [PW_PAD_SMOL]  (value not drawn)
Vbat-300  PW_PAD_SMOL  [PW_PAD_SMOL]  (value not drawn)

### Blocks framed on the sheet
OUTPUT_MOSFETs: C302 C312 C321 Motor_U300 Motor_V300 Motor_W300 Q300-Q305 R301 R304
Input Buffer: C301 C303 C306-C308 C311 C313 C314 C317 C319 C320 Vbat+300 Vbat-300
DRV8323H IO: C300 C304 C305 C309 C310 C315 C316 C318 IC300 R300
DRV AUX: C322 LED300 R302 R303 R305 S300 U300

### Ports
ADC_IN_0 (bidir), ADC_IN_1 (bidir), CAL (bidir), DVDD (bidir), EN_A (bidir), EN_C (bidir), ENABLE (bidir), ENO (bidir), GHA (bidir), GHB (bidir), GHC (bidir), GLA (bidir), GLB (bidir), GLC (bidir), GND (bidir), NFAULT (bidir), PWM_U_H (bidir), PWM_U_L (bidir), PWM_V_H (bidir), PWM_V_L (bidir), PWM_W_H (bidir), PWM_W_L (bidir), SHA (bidir), SHB (bidir), SHC (bidir), SNA (bidir), SNB (bidir), SPA (bidir), SPB (bidir), SPC (bidir), VCP (bidir)

### Nets
+5: C318.2 IC300.24(VREF)
GND: C300.1 C301.1 C302.1 C303.1 C304.1 C305.1 C306.1 C307.1 C308.1 C311.1 C312.1 C313.1 C314.1 C315.1 C316.1 C317.2 C318.1 C319.2 C320.2 C321.1 C322.1 IC300.19(SPC) IC300.20(SNC) IC300.26(MODE) IC300.32(AGND) IC300.40(PGND) IC300.41(EP_(GND)) Q305.1(S_1) Q305.2(S_2) Q305.3(S_3) R300.2 R301.1 R304.1 S300.3(COM_1) S300.4(COM_2) U300.2(GND) Vbat-300.1 ; port GND, port SPC
VB+: C301.2 C302.2 C303.2 C306.2 C307.2 C308.2 C310.1 C311.2 C312.2 C313.2 C314.2 C315.2 C316.2 C317.1 C319.1 C320.1 C321.2 IC300.4(VM) IC300.5(VDRAIN) Q300.5(D_1) Q300.6(D_2) Q300.7(D_3) Q300.8(D_4) Q300.9(D_5) Q302.5(D_1) Q302.6(D_2) Q302.7(D_3) Q302.8(D_4) Q302.9(D_5) Q304.5(D_1) Q304.6(D_2) Q304.7(D_3) Q304.8(D_4) Q304.9(D_5) Vbat+300.1
ADC_IN_0: IC300.23(SOA) ; port ADC_IN_0
ADC_IN_1: IC300.22(SOB) ; port ADC_IN_1
CAL: IC300.31(CAL) ; port CAL
DVDD: C300.2 C304.2 C305.2 IC300.27(IDRIVE) IC300.29(GAIN) IC300.33(DVDD) R302.1 R305.2 U300.5(VCC) ; port DVDD
EN_A: R302.2 R303.1 S300.1(NO_1) S300.2(NO_2) U300.1(A) ; port EN_A
EN_C: U300.6(C) ; port EN_C
ENABLE: IC300.30(ENABLE) U300.4(Y) ; port ENABLE
ENO: U300.3(B) ; port ENO
GHA: IC300.6(GHA) Q300.4(G) ; port GHA
GHB: IC300.15(GHB) Q302.4(G) ; port GHB
GHC: IC300.16(GHC) Q304.4(G) ; port GHC
GLA: IC300.8(GLA) Q301.4(G) ; port GLA
GLB: IC300.13(GLB) Q303.4(G) ; port GLB
GLC: IC300.18(GLC) Q305.4(G) ; port GLC
NFAULT: IC300.25(NFAULT) LED300.1(K) ; port NFAULT
PWM_U_H: IC300.38(INHC) ; port PWM_U_H
PWM_U_L: IC300.39(INLC) ; port PWM_U_L
PWM_V_H: IC300.36(INHB) ; port PWM_V_H
PWM_V_L: IC300.37(INLB) ; port PWM_V_L
PWM_W_H: IC300.34(INHA) ; port PWM_W_H
PWM_W_L: IC300.35(INLA) ; port PWM_W_L
SHA: IC300.7(SHA) Motor_W300.1 Q300.1(S_1) Q300.2(S_2) Q300.3(S_3) Q301.5(D_1) Q301.6(D_2) Q301.7(D_3) Q301.8(D_4) Q301.9(D_5) ; port SHA
SHB: IC300.14(SHB) Motor_V300.1 Q302.1(S_1) Q302.2(S_2) Q302.3(S_3) Q303.5(D_1) Q303.6(D_2) Q303.7(D_3) Q303.8(D_4) Q303.9(D_5) ; port SHB
SHC: IC300.17(SHC) Motor_U300.1 Q304.1(S_1) Q304.2(S_2) Q304.3(S_3) Q305.5(D_1) Q305.6(D_2) Q305.7(D_3) Q305.8(D_4) Q305.9(D_5) ; port SHC
SNA: IC300.10(SNA) R301.2 ; port SNA
SNB: IC300.11(SNB) R304.2 ; port SNB
SPA: IC300.9(SPA) R301.3 ; port SPA
SPB: IC300.12(SPB) R304.3 ; port SPB
VCP: C310.2 IC300.3(VCP) ; port VCP
NetC309_1: C309.1 IC300.2(CPH)
NetC309_2: C309.2 IC300.1(CPL)
NetC322_2: C322.2 R303.2
NetIC300_28: IC300.28(VDS) R300.1
NetLED300_2: LED300.2(A) R305.1
NetQ301_1: Q301.1(S_1) Q301.2(S_2) Q301.3(S_3) R301.4
NetQ303_1: Q303.1(S_1) Q303.2(S_2) Q303.3(S_3) R304.4

Not connected (* = marked no-connect by the designer): IC300 21(SOC)*

### Notes on the sheet
- Title
- Size:
- Date:
- A4
- Number:
- Time:
- Revision:
- Sheet
- of
- File:

### Library data of the parts
C300 C301 C303 C306-C308 C310 C311 C313-C315 = CL32B106KMVNNWE: as C100 on sheet modFOC-Motion_Controller; Datasheet Link: https://www.arrow.com/en/products/cl32b106kmvnnwe/samsung-electro-mechanics; Height: 2.8mm; Manufacturer_Part_Number: CL32B106KMVNNWE; Arrow Part Number: CL32B106KMVNNWE; Arrow Price/Stock: https://www.arrow.com/en/products/cl32b106kmvnnwe/samsung-electro-mechanics; Mouser Part Number: 187-CL32B106KMVNNWE; Mouser Price/Stock: https://www.mouser.co.uk/ProductDetail/Samsung-Electro-Mechanics/CL32B106KMVNNWE?qs=xZ%2FP%252Ba9zWqaEMBbSgKy8gQ%3D%3D
C302 C312 C321 = 08051C474KAT2A: Capacitor; Manufacturer_Name: AVX; Datasheet Link: http://datasheets.avx.com/X7RDielectric.pdf; Height: 1.4mm; Manufacturer_Part_Number: 08051C474KAT2A; Mouser Part Number: 581-08051C474KAT2A; Mouser Price/Stock: https://www.mouser.co.uk/ProductDetail/AVX/08051C474KAT2A?qs=%2FjdEcI0p95Mz%2FN5KbrGN6Q%3D%3D
C304 C305 C316-C320 = C0805C104MMREC7210: as C103 on sheet modFOC-Motion_Controller; Datasheet Link: http://www.vishay.com/docs/45226/vj31xrohsautomlcc.pdf; Height: 1mm; Mouser Part Number: 77-VJ0603Y104JXJAC; Mouser Price/Stock: https://www.mouser.com/Search/Refine.aspx?Keyword=77-VJ0603Y104JXJAC
C309 = CGA3E2X7R1H473K080AA: Capacitor; Manufacturer_Name: TDK; Datasheet Link: http://docs-emea.rs-online.com/webdocs/14e9/0900766b814e9125.pdf; Height: 0.9mm; Manufacturer_Part_Number: CGA3E2X7R1H473K080AA; Mouser Part Number: 810-CGA3E2X7R1H473K; Mouser Price/Stock: https://www.mouser.co.uk/ProductDetail/TDK/CGA3E2X7R1H473K080AA?qs=NRhsANhppD%252BXNlr9LoLgTw%3D%3D; Arrow Part Number: CGA3E2X7R1H473K080AA; Arrow Price/Stock: https://www.arrow.com/en/products/cga3e2x7r1h473k080aa/tdk
C322 = CL10A475KP8NNNC: as C102 on sheet modFOC-Motion_Controller; Datasheet Link: https://www.arrow.com/en/products/cl10a475kp8nnnc/samsung-electro-mechanics; Height: 0.9mm; Manufacturer_Part_Number: CL10A475KP8NNNC; Mouser Part Number: 187-CL10A475KP8NNNC; Mouser Price/Stock: https://www.mouser.co.uk/ProductDetail/Samsung-Electro-Mechanics/CL10A475KP8NNNC/?qs=hqM3L16%252BxlfQRmkWsZz5vA%3D%3D; Arrow Part Number: CL10A475KP8NNNC; Arrow Price/Stock: https://www.arrow.com/en/products/cl10a475kp8nnnc/samsung-electro-mechanics
IC300 = DRV8323HRTAR: Integrated Circuit; Manufacturer_Name: Texas Instruments; Datasheet Link: http://www.ti.com/lit/gpn/drv8323; Height: 0.8mm; Manufacturer_Part_Number: DRV8323HRTAR; Mouser Part Number: 595-DRV8323HRTAR; Mouser Price/Stock: https://www.mouser.co.uk/ProductDetail/Texas-Instruments/DRV8323HRTAR?qs=u4fy%2FsgLU9N%252BsI8bz2iwaQ%3D%3D; Arrow Part Number: DRV8323HRTAR; Arrow Price/Stock: https://www.arrow.com/en/products/drv8323hrtar/texas-instruments
LED300 = LS_L29K-G1J2-1-Z: LED; Manufacturer_Name: OSRAM; Manufacturer_Part_Number: LS L29K-G1J2-1-Z; Datasheet Link: https://dammedia.osram.info/media/resource/hires/osram-dam-5662679/LS%20L29K_EN.pdf; Height: 0.67mm; Mouser Part Number: 720-LSL29K-G1J2-1-Z; Mouser Price/Stock: https://www.mouser.co.uk/ProductDetail/OSRAM-Opto-Semiconductors/LS-L29K-G1J2-1-Z?qs=nTDll3UaDK6mUW9LNPY0Mw%3D%3D
Q300-Q305 = TPH2R506PL,L1Q: MOSFET (N-Channel); Manufacturer_Name: Toshiba; Datasheet Link: http://toshiba.semicon-storage.com/info/docget.jsp?did=55522&prodName=TPH2R506PL; Height: 1mm; Manufacturer_Part_Number: TPH2R506PL,L1Q; Mouser Part Number: 757-TPH2R506PLL1Q; Mouser Price/Stock: https://www.mouser.co.uk/ProductDetail/Toshiba/TPH2R506PLL1Q?qs=bUPhaerQQeFGJjj6SxbPEQ%3D%3D; Arrow Part Number: TPH2R506PL,L1Q; Arrow Price/Stock: https://www.arrow.com/en/products/tph2r506pll1q/toshiba
R300 = RC0603FR-071ML: Resistor; Manufacturer_Name: YAGEO (PHYCOMP); Datasheet Link: https://www.yageo.com/upload/media/product/productsearch/datasheet/rchip/PYu-RC_Group_51_RoHS_L_11.pdf; Height: 0.55mm; Manufacturer_Part_Number: RC0603FR-071ML; Mouser Part Number: 603-RC0603FR-071ML; Mouser Price/Stock: https://www.mouser.co.uk/ProductDetail/Yageo/RC0603FR-071ML/?qs=VU8sRB4EgwDPceeQKB324w%3D%3D; Arrow Part Number: RC0603FR-071ML; Arrow Price/Stock: https://www.arrow.com/en/products/rc0603fr-071ml/yageo
R301 R304 = WSK1216L5000FEA: Resistor; Manufacturer_Name: Vishay; Datasheet Link: http://www.vishay.com/docs/30189/wsk1216.pdf; Height: 1.9mm; Manufacturer_Part_Number: WSK1216L5000FEA
R302 = RC0603FR-0710KL: as R100 on sheet modFOC-Motion_Controller; Datasheet Link: http://www.yageo.com/documents/recent/PYu-RC0603_51_RoHS_L_v5.pdf; Height: 0.55mm; Manufacturer_Part_Number: RC0603FR-0710KL; Arrow Part Number: RC0603FR-0710KL; Arrow Price/Stock: https://www.arrow.com/en/products/rc0603fr-0710kl/yageo; Mouser Part Number: 603-RC0603FR-0710KL; Mouser Price/Stock: https://www.mouser.co.uk/ProductDetail/Yageo/RC0603FR-0710KL?qs=grNVn54RoB%252B3GtjbJj3wJQ%3D%3D
R303 = CRCW0603100RFKEAC: Resistor; Manufacturer_Name: Vishay; Datasheet Link: https://componentsearchengine.com/Datasheets/1/CRCW0603100RFKEAC.pdf; Height: 0.55mm; Manufacturer_Part_Number: CRCW0603100RFKEAC; Mouser Part Number: 71-CRCW0603100RFKEAC; Mouser Price/Stock: https://www.mouser.co.uk/ProductDetail/Vishay-Dale/CRCW0603100RFKEAC/?qs=E3Y5ESvWgWPJqb4%2F19sAKw%3D%3D; Arrow Part Number: CRCW0603100RFKEAC; Arrow Price/Stock: https://www.arrow.com/en/products/crcw0603100rfkeac/vishay
R305 = RC0603FR-10470RL: Resistor; Manufacturer_Name: YAGEO (PHYCOMP); Datasheet Link: http://www.yageo.com/documents/recent/PYu-RC0603_51_RoHS_L_v5.pdf; Height: 0.55mm; Manufacturer_Part_Number: RC0603FR-10470RL; Mouser Part Number: 603-RC0603FR-10470RL; Mouser Price/Stock: https://www.mouser.co.uk/ProductDetail/Yageo/RC0603FR-10470RL?qs=EiqXWrxQq62gi8HBTlzDog%3D%3D
S300 = PTS647SK38SMTR2LFS: as S100 on sheet modFOC-Motion_Controller; Datasheet Link: https://www.ckswitches.com/media/2567/pts647.pdf; Height: 3.8mm; Manufacturer_Part_Number: PTS647SK38SMTR2LFS; Mouser Part Number: 611-PTS647SK38SMTR2L; Mouser Price/Stock: https://www.mouser.co.uk/ProductDetail/CK/PTS647SK38SMTR2LFS/?qs=PqoDHHvF649Jgx1Ch2uMjg%3D%3D
U300 = 74LVC1G11W6-7: 3 Input AND Gate; Manufacturer_Name: Diodes Inc.; Datasheet Link: https://www.diodes.com/assets/Datasheets/74LVC1G11.pdf; Height: 1.4mm; Manufacturer_Part_Number: 74LVC1G11W6-7; Mouser Part Number: 621-74LVC1G11W6-7; Mouser Price/Stock: https://www.mouser.com/Search/Refine.aspx?Keyword=621-74LVC1G11W6-7; Arrow Part Number: 74LVC1G11W6-7; Arrow Price/Stock: https://www.arrow.com/en/products/74lvc1g11w6-7/diodes-incorporated

## Nets that join several sheets
3V3: modFOC-Motion_Controller (24 pins), modFOC-Sensing (C200.2 IC200.8 R205.2)
+5: modFOC-Motion_Controller (7 pins), modFOC-Sensing (9 pins), modFOC-Powerstage (C318.2 IC300.24)
GND: modFOC-Motion_Controller (43 pins), modFOC-Sensing (18 pins), modFOC-Powerstage (37 pins)
VB+: modFOC-Sensing (R213.2), modFOC-Powerstage (35 pins)
ADC_I0_N: modFOC-Motion_Controller (IC_100.17), modFOC-Sensing (R211.1 R216.1)
ADC_I0_P: modFOC-Motion_Controller (IC_100.16), modFOC-Sensing (C204.2 R210.1)
ADC_I1_N: modFOC-Motion_Controller (IC_100.19), modFOC-Sensing (R212.2 R217.1)
ADC_I1_P: modFOC-Motion_Controller (IC_100.18), modFOC-Sensing (C206.2 R215.1)
ADC_IN_0: modFOC-Sensing (R210.2), modFOC-Powerstage (IC300.23)
ADC_IN_1: modFOC-Sensing (R215.2), modFOC-Powerstage (IC300.22)
ADC_VM: modFOC-Motion_Controller (IC_100.20), modFOC-Sensing (C205.2 D200.3 R213.1 R214.2)
CAL: modFOC-Motion_Controller (IC_100.70), modFOC-Powerstage (IC300.31)
EN_C: modFOC-Motion_Controller (IC_100.71), modFOC-Powerstage (U300.6)
ENO: modFOC-Motion_Controller (IC_100.32), modFOC-Powerstage (U300.3)
HALL_U: modFOC-Motion_Controller (IC_100.38), modFOC-Sensing (IC200.2)
HALL_V: modFOC-Motion_Controller (IC_100.37), modFOC-Sensing (IC200.5)
HALL_W: modFOC-Motion_Controller (IC_100.36), modFOC-Sensing (IC200.7)
NFAULT: modFOC-Motion_Controller (IC_100.76), modFOC-Powerstage (IC300.25 LED300.1)
PWM_U_H: modFOC-Motion_Controller (IC_100.39), modFOC-Powerstage (IC300.38)
PWM_U_L: modFOC-Motion_Controller (IC_100.40), modFOC-Powerstage (IC300.39)
PWM_V_H: modFOC-Motion_Controller (IC_100.41), modFOC-Powerstage (IC300.36)
PWM_V_L: modFOC-Motion_Controller (IC_100.42), modFOC-Powerstage (IC300.37)
PWM_W_H: modFOC-Motion_Controller (IC_100.46), modFOC-Powerstage (IC300.34)
PWM_W_L: modFOC-Motion_Controller (IC_100.47), modFOC-Powerstage (IC300.35)
STATUS: modFOC-Motion_Controller (IC_100.12), modFOC-Sensing (R206.2)